# Altium schematic sheet CONN.SchDoc
size A
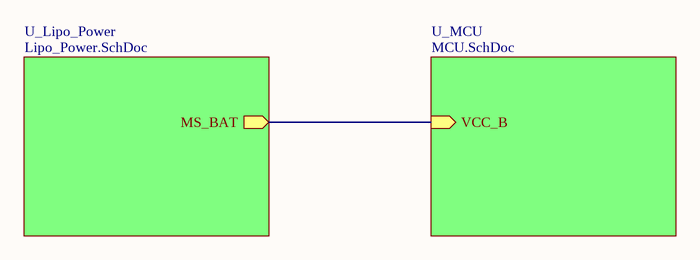
[diagram p0: CONN.SchDoc]

## Sub-sheets
U_Lipo_Power = Lipo_Power.SchDoc: MS_BAT (out)
U_MCU = MCU.SchDoc: VCC_B (in)

## Nets
(unnamed): sheet U_Lipo_Power/MS_BAT, sheet U_MCU/VCC_B